# EAGLE design 01-eagleClass-555 (EAGLE 7.6.0)
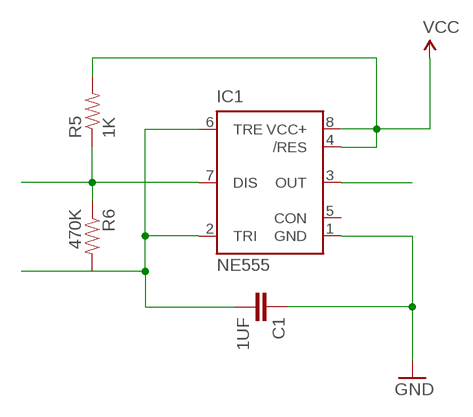
[diagram p0: schematic, sheet 1]

## Parts
C1  1UF  CAP_  [AXIAL-5MM]
IC1  NE555  [DIL-08]
R5  1K  1KOHM-1/4W-5%(PTH)HORIZ-KIT  [AXIAL-0.3EZ]
R6  470K  1KOHM-1/4W-5%(PTH)HORIZ-KIT  [AXIAL-0.3EZ]

## Nets
DISCHARGE: IC1.7(DIS) R5.P$1 R6.P$1
GND: C1.P$1 IC1.1(GND)
OUT: IC1.3(OUT)
THRESHOLD: C1.P$2 IC1.2(TRI) IC1.6(TRE) R6.P$2
VCC: IC1.4(/RES) IC1.8(VCC+) R5.P$2
Unconnected: IC1.5(CON)

## Library data of the parts
C1 = SparkFun-Capacitors:CAP: Capacitor Standard 0603 ceramic capacitor, and 0.1" leaded capacitor.; PROD_ID: 445-8517-ND
IC1 = st-microelectronics:NE555: General purpose bipolar Timer; MF: Arrow Electronics; MPN: NE555N; OC_FARNELL: 1467742; OC_NEWARK: 89K1486; PROD_ID: 296-1857-5-ND
R5 = SparkFun-Resistors:1KOHM-1/4W-5%(PTH): RES-08380; PROD_ID: 1.0KQBK-ND; VALUE: 1k
R6 = SparkFun-Resistors:1KOHM-1/4W-5%(PTH): RES-08380; PROD_ID: RES-08380; VALUE: 1k

## Board
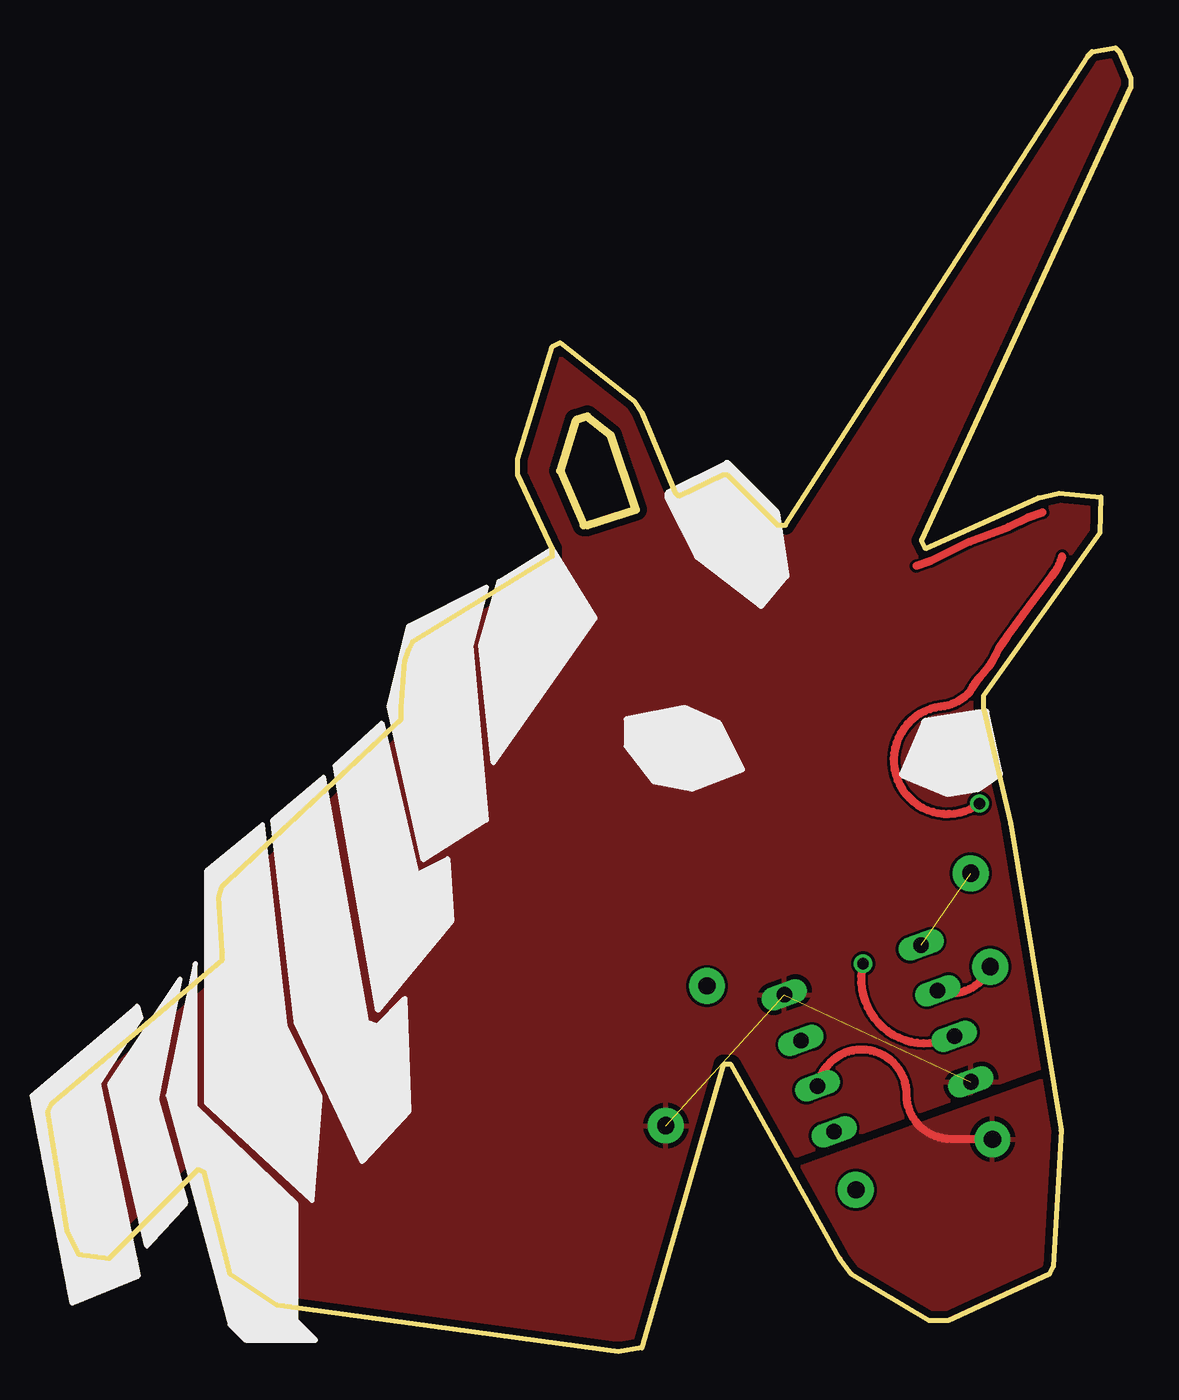
[diagram p1: board, top side]
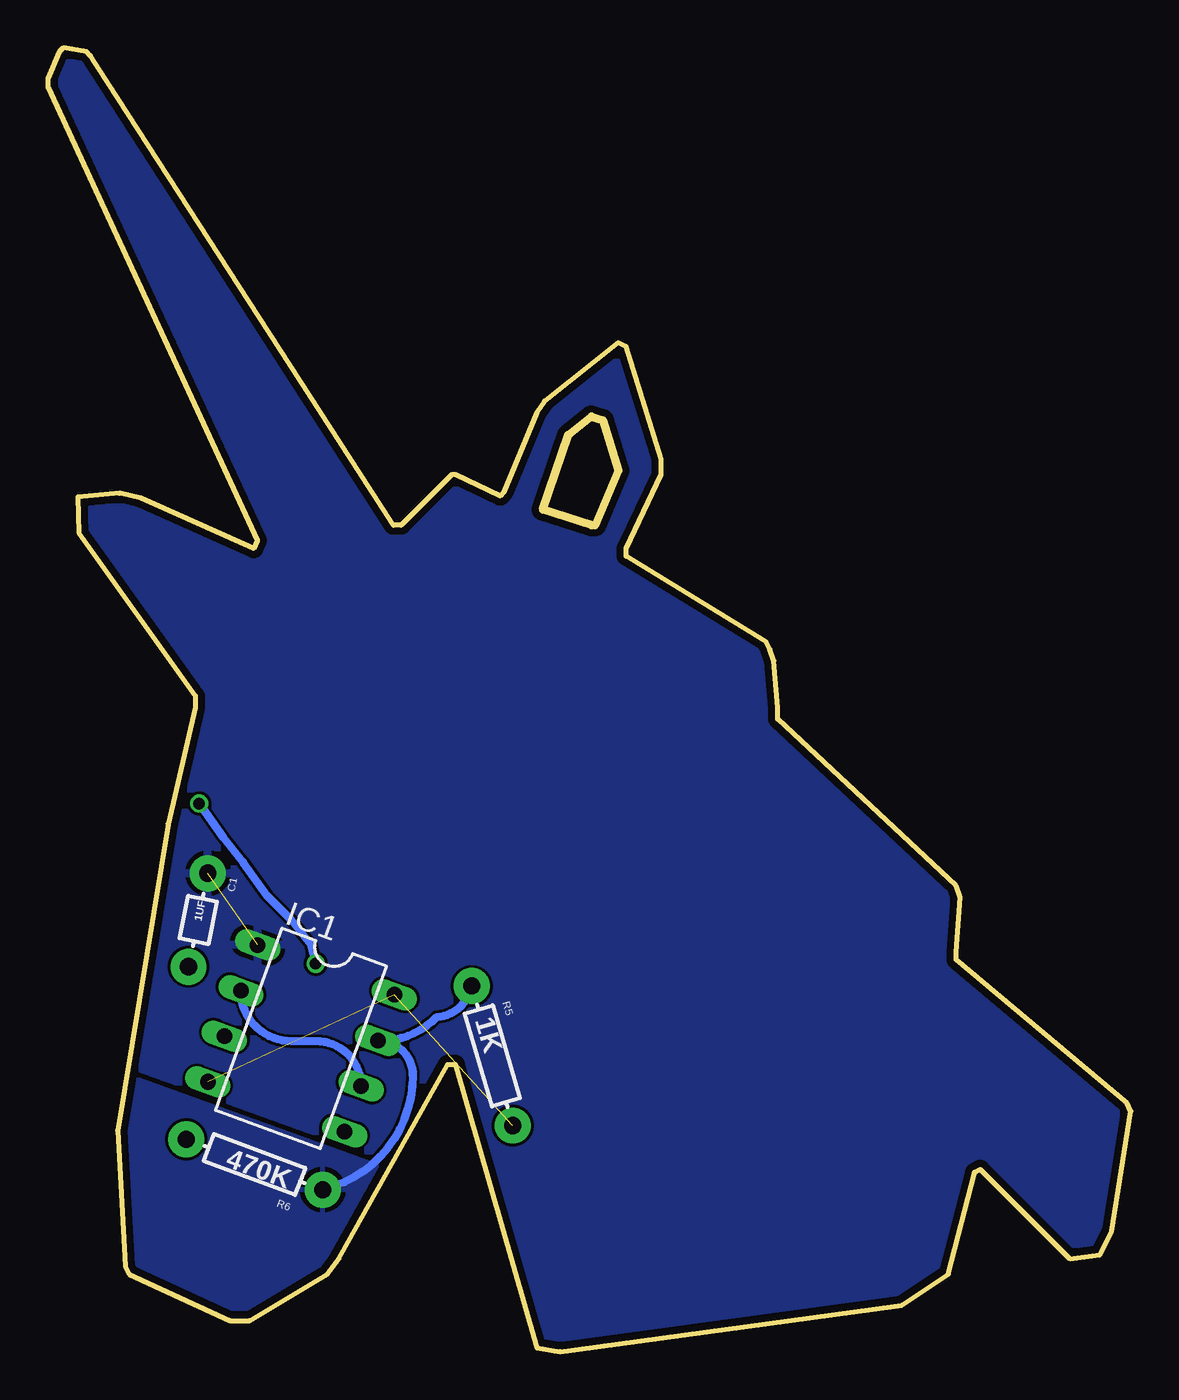
[diagram p2: board, bottom side, seen from below]

Size 56.69 x 68.28 mm. Coordinates in mm from the lower left corner, seen from the top.
Outline: 28.25,43.28 30.79,44.09 29.46,48.01 28.25,48.97 27.64,48.77 26.82,46.13 28.04,43.28
Outline: 1.63,5.08 1.02,6.3 0,12.6 0.2,13.01 9.14,20.52 9.14,20.93 8.94,23.77 9.14,24.38 18.49,33.12 18.49,33.73 18.69,36.17 18.9,36.78 19.1,37.19 26.42,41.66 26.42,42.06 24.59,45.92 24.59,46.74 26.42,52.63 26.82,52.83 30.68,49.78 31.09,49.17 32.82,45.01 33.02,44.81 35.36,45.92 35.56,45.92 38.2,43.28 38.61,43.28 54.46,67.87 54.66,68.07 55.88,68.27 56.08,68.07 56.69,66.65 56.69,66.24 45.72,42.47 45.92,42.06 51.82,44.7 52.93,44.96 55.12,44.76 55.07,42.88 48.97,34.34 48.97,33.73 50.39,27.63 53.03,11.58 52.63,4.47 52.43,4.06 47.14,1.63 46.13,1.63 42.06,4.06 41.45,4.88 35.76,15.04 35.36,15.04 31.09,0.2 29.87,0 11.99,2.44 9.55,4.06 8.18,9.4 7.87,9.55 3.2,4.88 1.63,5.08
Copper layers (1*16): Top 0.0356mm / dielectric 1.5011mm / Bottom 0.0356mm
Design rules "LaenPCBOrder": minimum track width 6mil, minimum drill 13mil, track to track 6mil, track to pad 6mil, pad to pad 6mil, via to via 6mil, smd to smd 6mil, copper to edge 15mil, drill to drill 6mil, minimum pad ring 7mil, minimum via ring 7mil, stop-mask expansion 4mil, vias tented up to drill 0mil, thermal gap 10mil

### Footprints (pad centres in the part's own frame; a part is rotated, then mirrored left to right if it is on the bottom)
AXIAL-5MM = drill 0.9 pad 1.88: P$1 -2.5,0; P$2 2.5,0
DIL-08 = drill 0.813 long: 1 -3.81,-3.81; 2 -1.27,-3.81; 3 1.27,-3.81; 4 3.81,-3.81; 5 3.81,3.81; 6 1.27,3.81; 7 -1.27,3.81; 8 -3.81,3.81
AXIAL-0.3EZ = drill 0.9 pad 1.88: P$1 -3.81,0; P$2 3.81,0

### Placement (x,y rotation side)
C1  48.82,22.61 258.3 bottom
IC1  43.43,16.41 250 bottom
R5  33.43,15.49 286.4 bottom
R6  45.87,9.8 159.7 bottom

### Tracks (layer width: path | path; a pad name or v marks a point on that pad's centre or on a via)
DISCHARGE
  Bottom 0.406: R6.P$1 arc-76 37.59,14.48 arc-90 IC1.7 39.28,16.3 arc-45 36.32,17.53 arc-74 R5.P$1
  pour Bottom: 38.4,9.35 53.64,14.83 53.24,3.86 46.74,0.61 41.05,4.06
GND  (1 unrouted)
  pour Bottom: 37.8,9.75 31.29,-1.22 7.11,2.03 0.41,3.86 -0.41,14.02 26.21,54.46 56.29,70.31 58.52,66.85 52.43,15.04
N$1
  Top 0.406: 52.07,43.94 51.31,43.69 50.29,43.18 48.26,42.42 46.23,41.4 45.47,41.15
OUT  (via drill 0.6)
  Top 0.406: 53.09,41.66 arc-22 52.58,40.64 arc1 51.05,38.61 arc1 49.78,36.83 arc-20 48.77,35.31 arc20 48.26,34.54 arc-43 46.74,33.78 arc209 v48.77,28.7 | v42.67,20.32 arc131 IC1.3
  Bottom 0.406: v48.77,28.7 47.5,26.92 46.48,25.65 45.21,23.88 43.94,22.61 42.93,21.34 v42.67,20.32
THRESHOLD
  Top 0.406: IC1.2 arc88 C1.P$2 | R6.P$2 47.29,11.13 arc-90 44.96,13.46 arc169 IC1.6
  Bottom 0.406: IC1.6 arc-90 42.63,16.26 43.93,16.26 arc90 IC1.2
  pour Top: 38,9.14 53.24,14.63 53.04,3.86 46.53,1.02 41.86,4.06
VCC  (2 unrouted)
  pour Top: 30.89,-0.61 -6.91,4.27 26.62,55.47 53.64,69.09 60.35,69.9 52.43,15.04 37.19,9.55